# Altium schematic sheet wire.SchDoc
size A3
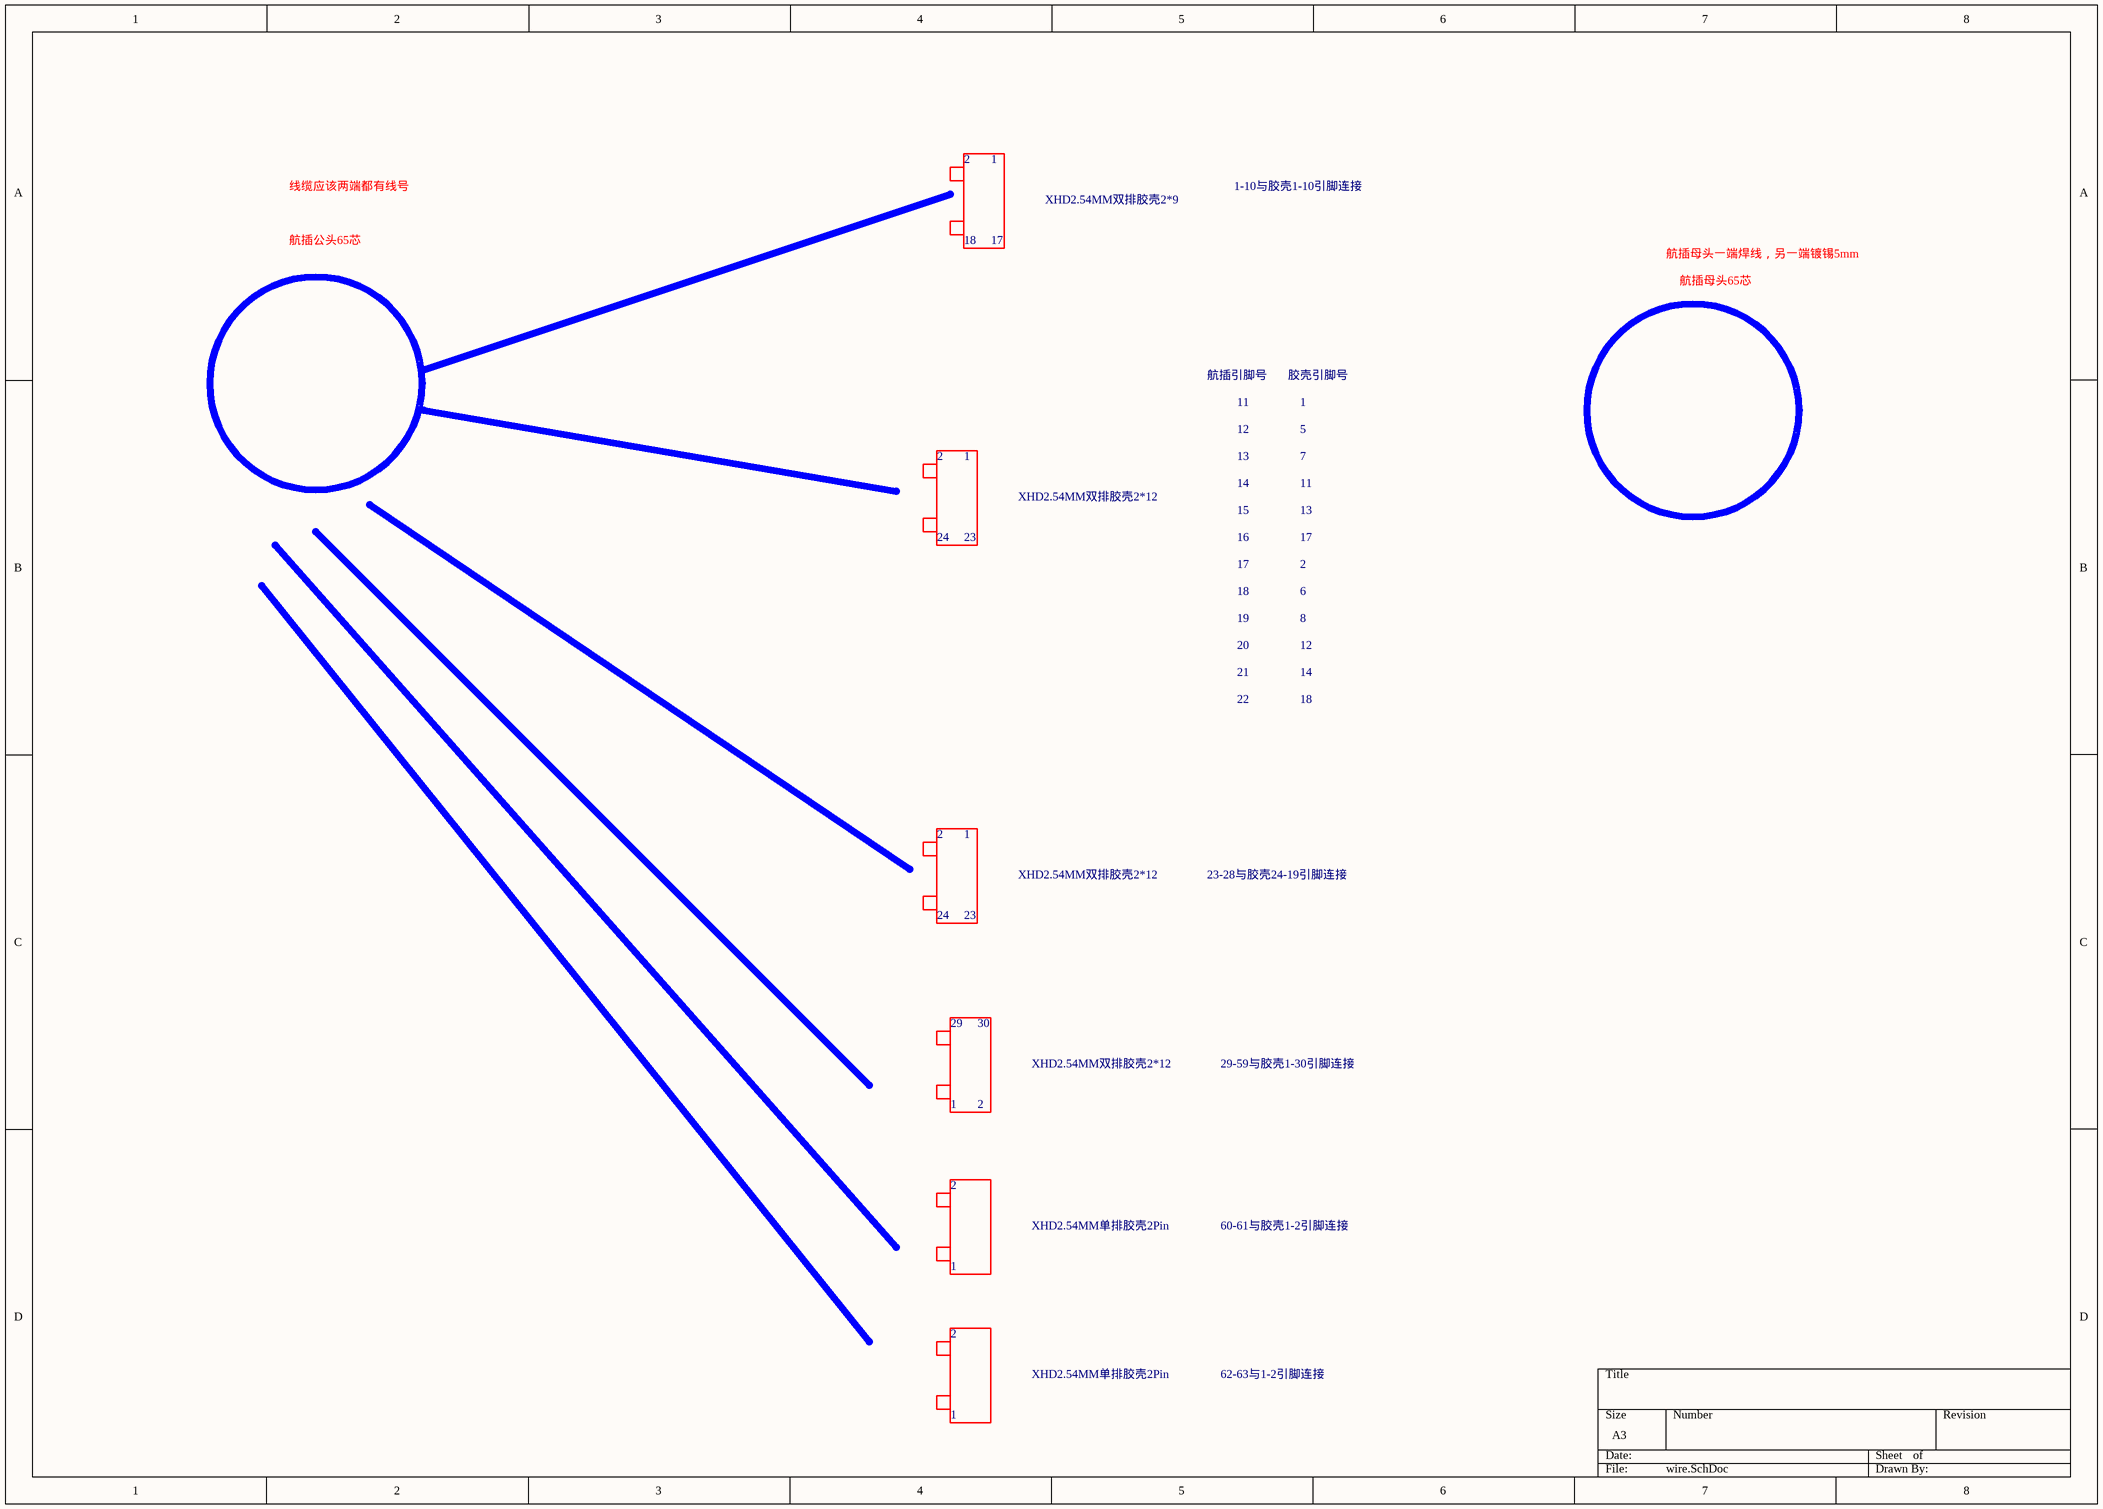
[diagram p0: wire.SchDoc]

## Notes on the sheet
- 2
- 1
- 航插公头65芯
- 线缆应该两端都有线号
- 18
- 17
- XHD2.54MM双排胶壳2*9
- 1-10与胶壳1-10引脚连接
- 航插母头一端焊线，另一端镀锡5mm
- 航插母头65芯
- 航插引脚号       胶壳引脚号
- 11                 1
- 12                 5
- XHD2.54MM双排胶壳2*12
- 13                 7
- 14                 11
- 15                 13
- 24
- 23
- 16                 17
- 17                 2
- 18                 6
- 19                 8
- 20                 12
- 21                 14
- 22                 18
- 23-28与胶壳24-19引脚连接
- 29
- 30
- 29-59与胶壳1-30引脚连接
- XHD2.54MM单排胶壳2Pin
- 60-61与胶壳1-2引脚连接
- 62-63与1-2引脚连接